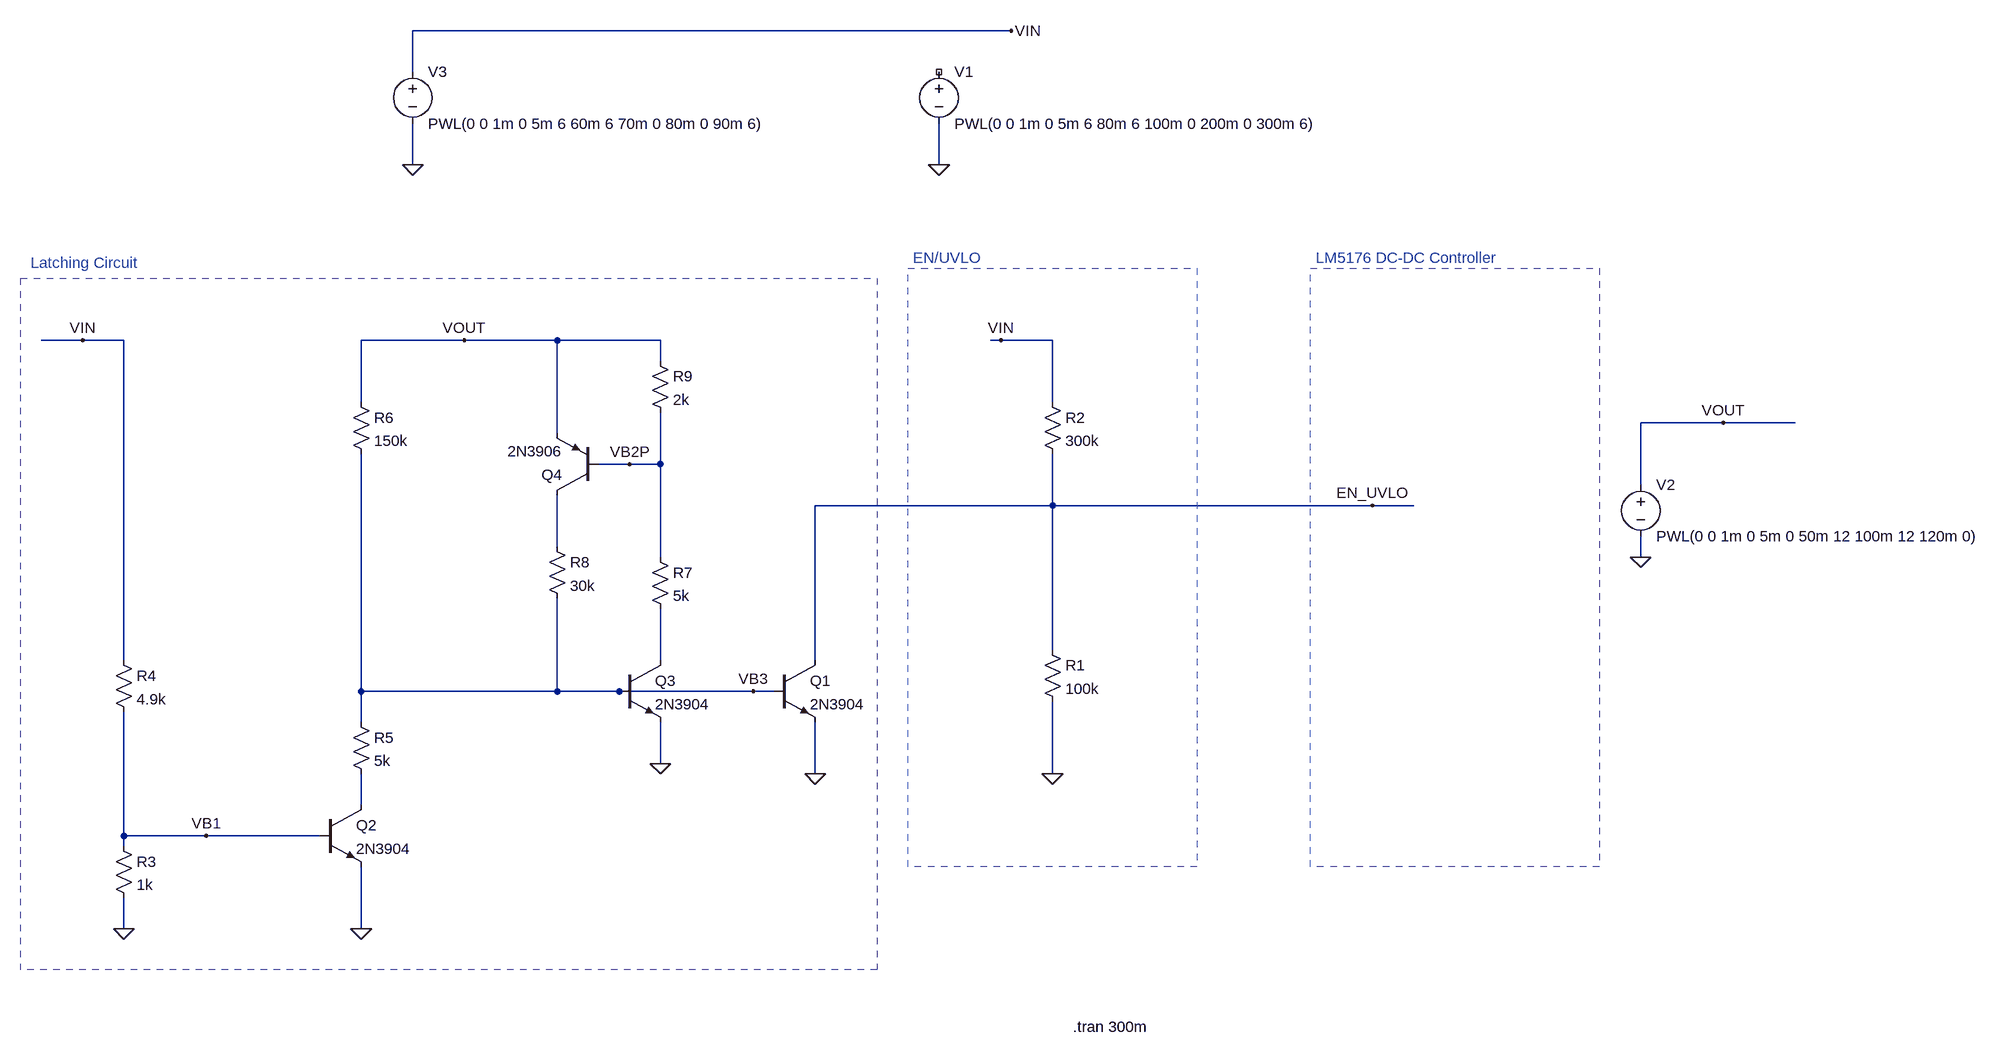
[diagram p0: schematic en_uvlo_lockoutv2.asc]
en_uvlo_lockoutv2.asc, the LTspice schematic file:
Version 4
SHEET 1 2676 788
WIRE 1136 -896 208 -896
WIRE 208 -832 208 -896
WIRE 208 -688 208 -752
WIRE 1024 -688 1024 -752
WIRE -304 -416 -368 -416
WIRE -240 -416 -304 -416
WIRE 288 -416 128 -416
WIRE 432 -416 288 -416
WIRE 592 -416 432 -416
WIRE 1120 -416 1104 -416
WIRE 1200 -416 1120 -416
WIRE 592 -384 592 -416
WIRE 128 -320 128 -416
WIRE 1200 -320 1200 -416
WIRE 2240 -288 2112 -288
WIRE 2352 -288 2240 -288
WIRE 432 -272 432 -416
WIRE 544 -224 496 -224
WIRE 592 -224 592 -304
WIRE 592 -224 544 -224
WIRE 2112 -192 2112 -288
WIRE 1200 -160 1200 -240
WIRE 1200 -160 832 -160
WIRE 1696 -160 1200 -160
WIRE 1760 -160 1696 -160
WIRE 432 -96 432 -176
WIRE 592 -80 592 -224
WIRE 2112 -80 2112 -112
WIRE 1200 64 1200 -160
WIRE -240 80 -240 -416
WIRE 592 80 592 0
WIRE 832 80 832 -160
WIRE 128 128 128 -240
WIRE 432 128 432 -16
WIRE 432 128 128 128
WIRE 528 128 432 128
WIRE 736 128 528 128
WIRE 768 128 736 128
WIRE 128 176 128 128
WIRE 592 240 592 176
WIRE 832 256 832 176
WIRE 1200 256 1200 144
WIRE 128 304 128 256
WIRE -240 352 -240 160
WIRE -112 352 -240 352
WIRE 64 352 -112 352
WIRE -240 368 -240 352
WIRE -240 496 -240 448
WIRE 128 496 128 400
FLAG -240 496 0
FLAG 128 496 0
FLAG 592 240 0
FLAG 832 256 0
FLAG 1200 256 0
FLAG 1024 -688 0
FLAG 2112 -80 0
FLAG 1136 -896 VIN
FLAG 1120 -416 VIN
FLAG 1696 -160 EN_UVLO
FLAG -112 352 VB1
FLAG 736 128 VB3
FLAG 544 -224 VB2P
FLAG 2240 -288 VOUT
FLAG -304 -416 VIN
FLAG 288 -416 VOUT
FLAG 208 -688 0
SYMBOL npn 64 304 R0
SYMATTR InstName Q2
SYMATTR Value 2N3904
SYMBOL pnp 496 -176 R180
SYMATTR InstName Q4
SYMATTR Value 2N3906
SYMBOL npn 768 80 R0
SYMATTR InstName Q1
SYMATTR Value 2N3904
SYMBOL res -256 64 R0
SYMATTR InstName R4
SYMATTR Value 4.9k
SYMBOL res -256 352 R0
SYMATTR InstName R3
SYMATTR Value 1k
SYMBOL res 112 -336 R0
SYMATTR InstName R6
SYMATTR Value 150k
SYMBOL res 112 160 R0
SYMATTR InstName R5
SYMATTR Value 5k
SYMBOL res 416 -112 R0
SYMATTR InstName R8
SYMATTR Value 30k
SYMBOL res 1184 -336 R0
SYMATTR InstName R2
SYMATTR Value 300k
SYMBOL res 1184 48 R0
SYMATTR InstName R1
SYMATTR Value 100k
SYMBOL npn 528 80 R0
SYMATTR InstName Q3
SYMATTR Value 2N3904
SYMBOL res 576 -96 R0
SYMATTR InstName R7
SYMATTR Value 5k
SYMBOL voltage 1024 -848 R0
WINDOW 123 0 0 Left 0
WINDOW 39 0 0 Left 0
SYMATTR InstName V1
SYMATTR Value PWL(0 0 1m 0 5m 6 80m 6 100m 0 200m 0 300m 6)
SYMBOL voltage 2112 -208 R0
WINDOW 123 0 0 Left 0
WINDOW 39 0 0 Left 0
SYMATTR InstName V2
SYMATTR Value PWL(0 0 1m 0 5m 0 50m 12 100m 12 120m 0)
SYMBOL voltage 208 -848 R0
WINDOW 123 0 0 Left 0
WINDOW 39 0 0 Left 0
SYMATTR InstName V3
SYMATTR Value PWL(0 0 1m 0 5m 6 60m 6 70m 0 80m 0 90m 6)
SYMBOL res 576 -400 R0
SYMATTR InstName R9
SYMATTR Value 2k
TEXT 1232 648 Left 2 !.tran 300m
TEXT 984 -544 Left 2 ;EN/UVLO
TEXT 1608 -544 Left 2 ;LM5176 DC-DC Controller
TEXT -384 -536 Left 2 ;Latching Circuit
RECTANGLE Normal 1424 400 976 -528 2
RECTANGLE Normal 2048 400 1600 -528 2
RECTANGLE Normal 928 560 -400 -512 2

The netlist it stands for:
* en_uvlo_lockoutv2.asc
Q2 N003 VB1 0 0 2N3904
Q4 N001 VB2P VOUT 0 2N3906
Q1 EN_UVLO VB3 0 0 2N3904
R4 VIN VB1 4.9k
R3 VB1 0 1k
R6 VOUT VB3 150k
R5 VB3 N003 5k
R8 N001 VB3 30k
R2 VIN EN_UVLO 300k
R1 EN_UVLO 0 100k
Q3 N002 VB3 0 0 2N3904
R7 VB2P N002 5k
V1 NC_01 0 PWL(0 0 1m 0 5m 6 80m 6 100m 0 200m 0 300m 6)
V2 VOUT 0 PWL(0 0 1m 0 5m 0 50m 12 100m 12 120m 0)
V3 VIN 0 PWL(0 0 1m 0 5m 6 60m 6 70m 0 80m 0 90m 6)
R9 VOUT VB2P 2k
.model NPN NPN
.model PNP PNP
.lib standard.bjt
.tran 300m
* EN/UVLO
* LM5176 DC-DC Controller
* Latching Circuit
.backanno
.end